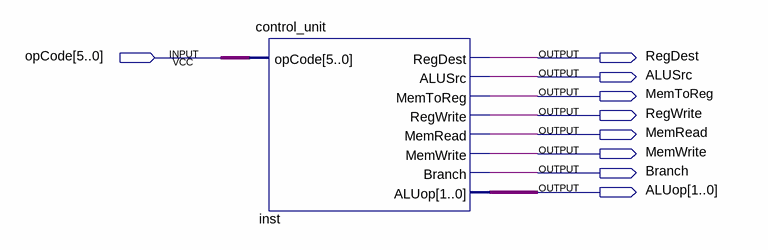
[diagram p0: schematic sheet]
// Quartus schematic Control_testing.bdf as structural Verilog: 1 symbols, 9 pins
module Control_testing (
  input  [5:0] opCode,
  output RegDest,
  output ALUSrc,
  output MemToReg,
  output RegWrite,
  output MemRead,
  output MemWrite,
  output Branch,
  output [1:0] ALUop
);

  control_unit inst (
    .opCode(opCode), .RegDest(RegDest), .ALUSrc(ALUSrc), .MemToReg(MemToReg), .RegWrite(RegWrite),
    .MemRead(MemRead), .MemWrite(MemWrite), .Branch(Branch), .ALUop(ALUop));
endmodule
